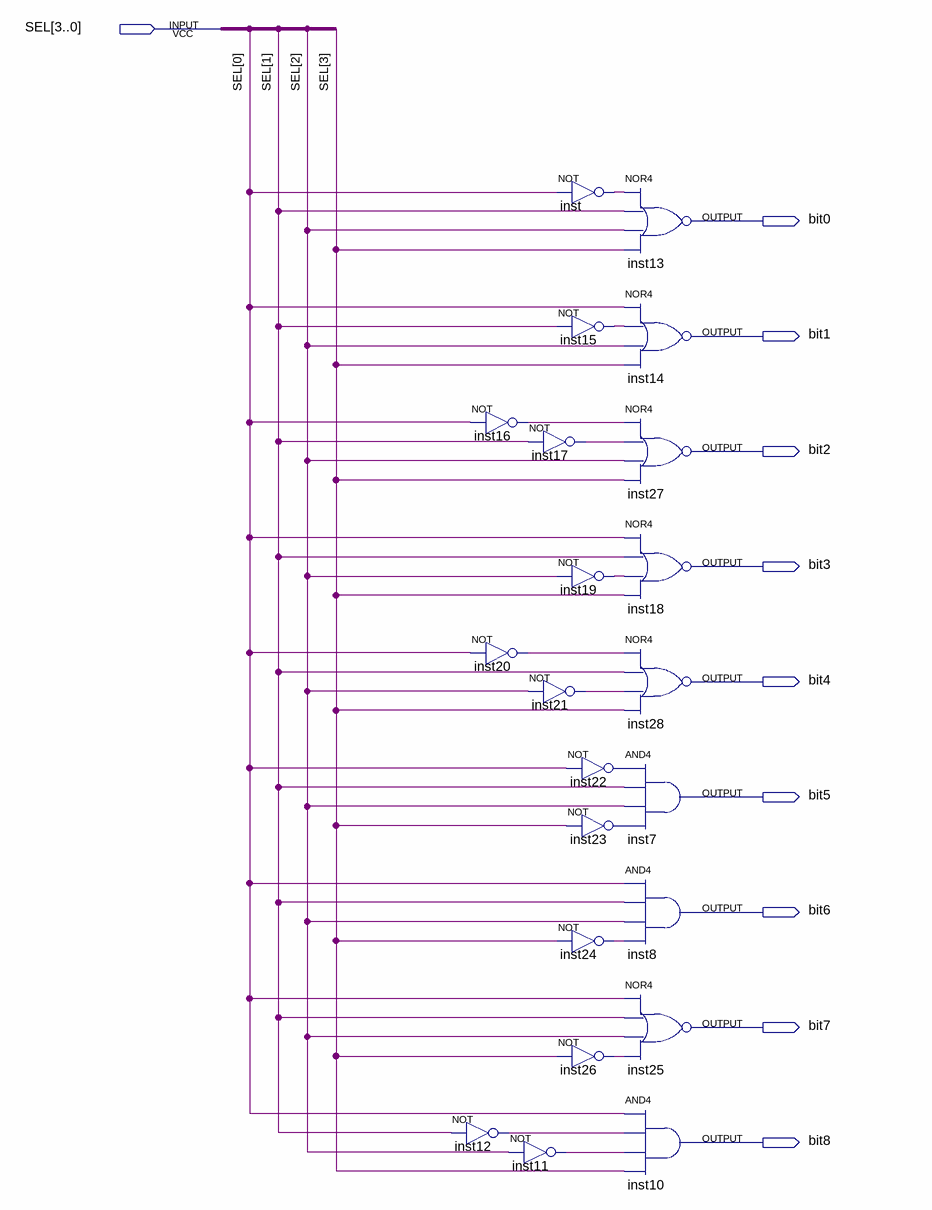
[diagram p0: schematic sheet]
// Quartus schematic seletor.bdf as structural Verilog: 22 symbols, 10 pins
module seletor (
  input  [3:0] SEL,
  output bit0,
  output bit1,
  output bit2,
  output bit3,
  output bit4,
  output bit5,
  output bit6,
  output bit7,
  output bit8
);

  wire inst11_out, inst12_out, inst15_out, inst16_out, inst17_out, inst19_out, inst20_out, inst21_out,
       inst22_out, inst23_out, inst24_out, inst26_out, inst_out;

  not inst16 (inst16_out, SEL[0]);
  not inst20 (inst20_out, SEL[0]);
  not inst12 (inst12_out, SEL[1]);
  not inst17 (inst17_out, SEL[1]);
  not inst21 (inst21_out, SEL[2]);
  not inst11 (inst11_out, SEL[2]);
  nor inst13 (bit0, inst_out, SEL[1], SEL[2], SEL[3]);
  not inst (inst_out, SEL[0]);
  nor inst14 (bit1, SEL[0], inst15_out, SEL[2], SEL[3]);
  not inst15 (inst15_out, SEL[1]);
  nor inst27 (bit2, inst16_out, inst17_out, SEL[2], SEL[3]);
  nor inst18 (bit3, SEL[0], SEL[1], inst19_out, SEL[3]);
  not inst19 (inst19_out, SEL[2]);
  nor inst28 (bit4, inst20_out, SEL[1], inst21_out, SEL[3]);
  and inst7 (bit5, inst22_out, SEL[1], SEL[2], inst23_out);
  not inst22 (inst22_out, SEL[0]);
  not inst23 (inst23_out, SEL[3]);
  and inst8 (bit6, SEL[0], SEL[1], SEL[2], inst24_out);
  not inst24 (inst24_out, SEL[3]);
  nor inst25 (bit7, SEL[0], SEL[1], SEL[2], inst26_out);
  not inst26 (inst26_out, SEL[3]);
  and inst10 (bit8, SEL[0], inst12_out, inst11_out, SEL[3]);
endmodule
